# Altium schematic sheet Beeper.SchDoc
size A4
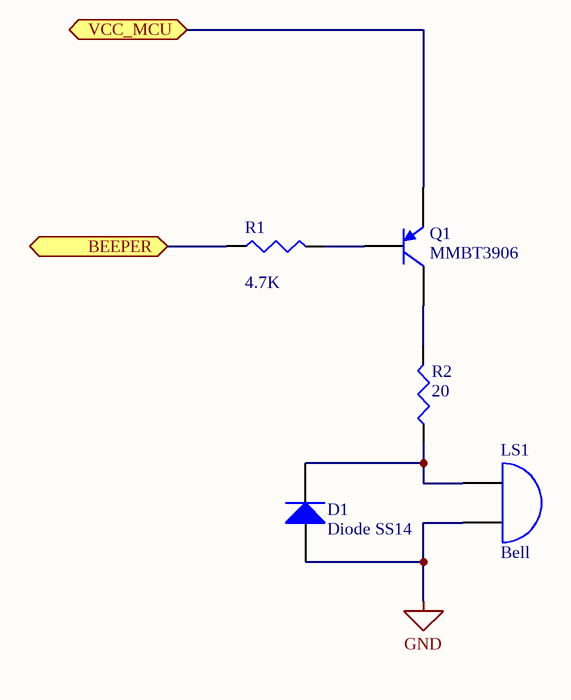
[diagram p0: Beeper.SchDoc]

## Parts
D1  Diode SS14  [SMA]
LS1  Bell  [BEEPER_SMD]
Q1  MMBT3906  [SOT23-3-PNP]
R1  value 4.7K  [0603]  (hidden comment: Res3)
R2  value 20  [0603]  (hidden comment: Res3)

## Ports
BEEPER (bidir), VCC_MCU (bidir)

## Nets
GND: D1.1(A) LS1.2(B)
BEEPER: R1.1 ; port BEEPER
VCC_MCU: Q1.3(E) ; port VCC_MCU
NetD1_2: D1.2(K) LS1.1(A) R2.1
NetQ1_1: Q1.1(C) R2.2
NetQ1_2: Q1.2(B) R1.2

## Library data of the parts
D1 = Diode 1N4005: 1 Amp General Purpose Rectifier; Published: 8-Jun-2000; LatestRevisionDate: 17-Jul-2002; LatestRevisionNote: Re-released for DXP Platform.; DatasheetVersion: 1998; PackageVersion: Aug-1999; PackageReference: DO-41; Publisher: Altium Limited; PackageDescription: Diode, Axial; Body 5.2 x 2.7 mm (LxDia. max), Lead Dia. 0.86 mm (max); Code_JEDEC: DO-204-AL; ComponentLink1Description: Manufacturer Link; ComponentLink1URL: http://www.fairchildsemi.com/; ComponentLink2Description: Datasheet; ComponentLink2URL: http://www.fairchildsemi.com/ds/1N%2F1N4001.pdf
LS1 = Bell: Electrical Bell; Published: 24-Mar-1999; LatestRevisionDate: 17-Jul-2002; LatestRevisionNote: Re-released for DXP Platform.; PackageReference: PIN2; Publisher: Altium Limited
Q1 = PNP: PNP Bipolar Transistor; Published: 8-Jun-2000; LatestRevisionDate: 29-May-2009; LatestRevisionNote: IPC-7351 Footprint Added.; PackageVersion: Aug-1999; PackageReference: SOT-23B; Publisher: Altium Limited; PackageDescription: 3-Pin SOT-23 Package 0.95 mm Pitch, 2.4 mm Lead Span
R1 R2 = Res3: Resistor; Published: 8-Jun-2000; LatestRevisionDate: 29-May-2009; LatestRevisionNote: IPC-7351 Footprint Added.; PackageReference: J1-0603; Publisher: Altium Limited; PackageDescription: Chip Resistor